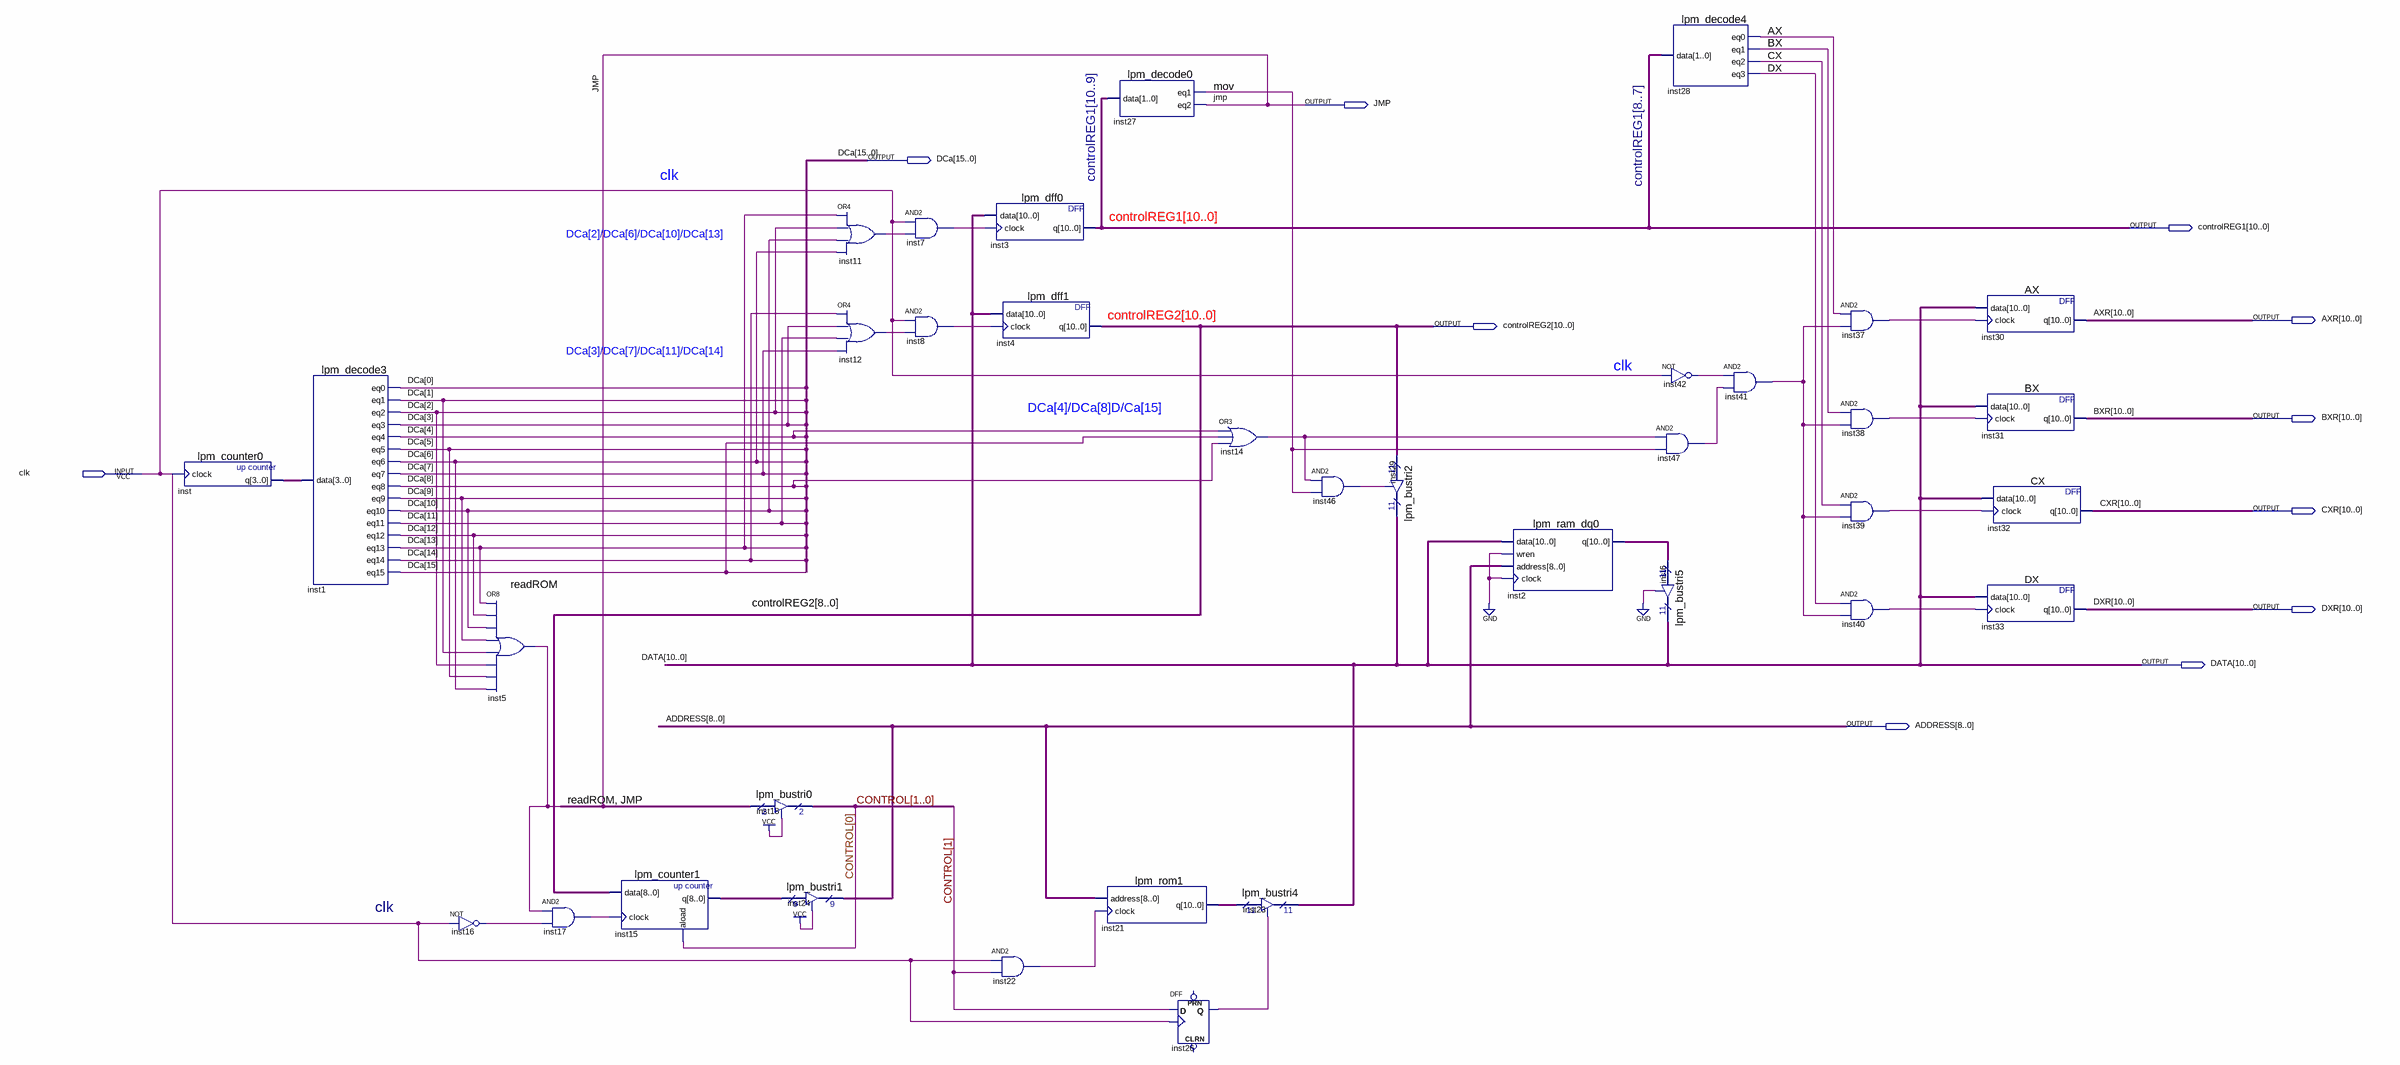
[diagram p0: schematic sheet]
// Quartus schematic SIFO_4.bdf as structural Verilog: 36 symbols, 11 pins
module SIFO_4 (
  input  clk,
  output JMP,
  output [15:0] DCa,
  output [10:0] controlREG1,
  output [10:0] AXR,
  output [10:0] controlREG2,
  output [10:0] BXR,
  output [10:0] CXR,
  output [10:0] DXR,
  output [10:0] DATA,
  output [8:0] ADDRESS
);

  wire AX, BX, CX, DX, inst7_out, inst8_out, inst11_out, inst12_out, inst14_out, inst16_out, inst17_out,
       inst22_out, inst26_q, inst37_out, inst38_out, inst39_out, inst40_out, inst41_out, inst42_out,
       inst46_out, inst47_out, mov, readROM;
  wire [1:0] CONTROL;
  wire [3:0] inst_q;
  wire [8:0] inst15_q;
  wire [10:0] inst2_q, inst21_q;

  lpm_counter0 inst (.clock(clk), .q(inst_q));
  lpm_decode3 inst1 (
    .data(inst_q), .eq0(DCa[0]), .eq1(DCa[1]), .eq2(DCa[2]), .eq3(DCa[3]), .eq4(DCa[4]), .eq5(DCa[5]),
    .eq6(DCa[6]), .eq7(DCa[7]), .eq8(DCa[8]), .eq9(DCa[9]), .eq10(DCa[10]), .eq11(DCa[11]), .eq12(DCa[12]),
    .eq13(DCa[13]), .eq14(DCa[14]), .eq15(DCa[15]));
  not inst16 (inst16_out, clk);
  or inst5 (readROM, DCa[13], DCa[12], DCa[10], DCa[9], DCa[1], DCa[2], DCa[5], DCa[6]);
  and inst17 (inst17_out, readROM, inst16_out);
  lpm_counter1 inst15 (.data(controlREG2[8:0]), .clock(inst17_out), .aload(CONTROL[0]), .q(inst15_q));
  lpm_bustri0 inst18 (.enabledt(1'b1), .data({readROM, JMP}), .tridata(CONTROL));
  lpm_bustri1 inst24 (.enabledt(1'b1), .data(inst15_q), .tridata(ADDRESS));
  or inst11 (inst11_out, DCa[13], DCa[2], DCa[10], DCa[6]);
  or inst12 (inst12_out, DCa[14], DCa[3], DCa[11], DCa[7]);
  and inst7 (inst7_out, clk, inst11_out);
  and inst8 (inst8_out, clk, inst12_out);
  lpm_dff0 inst3 (.data(DATA), .clock(inst7_out), .q(controlREG1));
  lpm_dff1 inst4 (.data(DATA), .clock(inst8_out), .q(controlREG2));
  and inst22 (inst22_out, clk, CONTROL[1]);
  lpm_decode0 inst27 (.data(controlREG1[10:9]), .eq1(mov), .eq2(JMP));
  lpm_rom1 inst21 (.address(ADDRESS), .clock(inst22_out), .q(inst21_q));
  DFF inst26 (.CLK(clk), .D(CONTROL[1]), .Q(inst26_q));  // open: CLRN, PRN
  or inst14 (inst14_out, DCa[4], DCa[15], DCa[8]);
  lpm_bustri4 inst23 (.enabledt(inst26_q), .data(inst21_q), .tridata(DATA));
  and inst46 (inst46_out, inst14_out, mov);
  lpm_bustri2 inst29 (.enabledt(inst46_out), .data(controlREG2), .tridata(DATA));
  lpm_ram_dq0 inst2 (.data(DATA), .wren(1'b0), .address(ADDRESS), .clock(1'b0), .q(inst2_q));
  and inst47 (inst47_out, inst14_out, mov);
  lpm_bustri5 inst6 (.enabledt(1'b0), .data(inst2_q), .tridata(DATA));
  lpm_decode4 inst28 (.data(controlREG1[8:7]), .eq0(AX), .eq1(BX), .eq2(CX), .eq3(DX));
  not inst42 (inst42_out, clk);
  and inst41 (inst41_out, inst42_out, inst47_out);
  and inst37 (inst37_out, AX, inst41_out);
  and inst38 (inst38_out, BX, inst41_out);
  and inst39 (inst39_out, CX, inst41_out);
  and inst40 (inst40_out, DX, inst41_out);
  AX inst30 (.data(DATA), .clock(inst37_out), .q(AXR));
  BX inst31 (.data(DATA), .clock(inst38_out), .q(BXR));
  CX inst32 (.data(DATA), .clock(inst39_out), .q(CXR));
  DX inst33 (.data(DATA), .clock(inst40_out), .q(DXR));

  // Notes on the sheet:
  //   DCa[2]/DCa[6]/DCa[10]/DCa[13]
  //   controlREG2[10..0]
  //   DCa[3]/DCa[7]/DCa[11]/DCa[14]
  //   clk
  //   DCa[4]/DCa[8]D/Ca[15]
  //   clk
endmodule
